# Altium schematic sheet rf_conn.SchDoc: mcHF Pro Transceiver RF board
size A3; Author: Krassi Atanassov; CompanyName: MØNKA; Engineer: For radio amateurs experimentation, non-commercial use only. Thank you!; Revision: 0.8.5; SheetTotal: 14
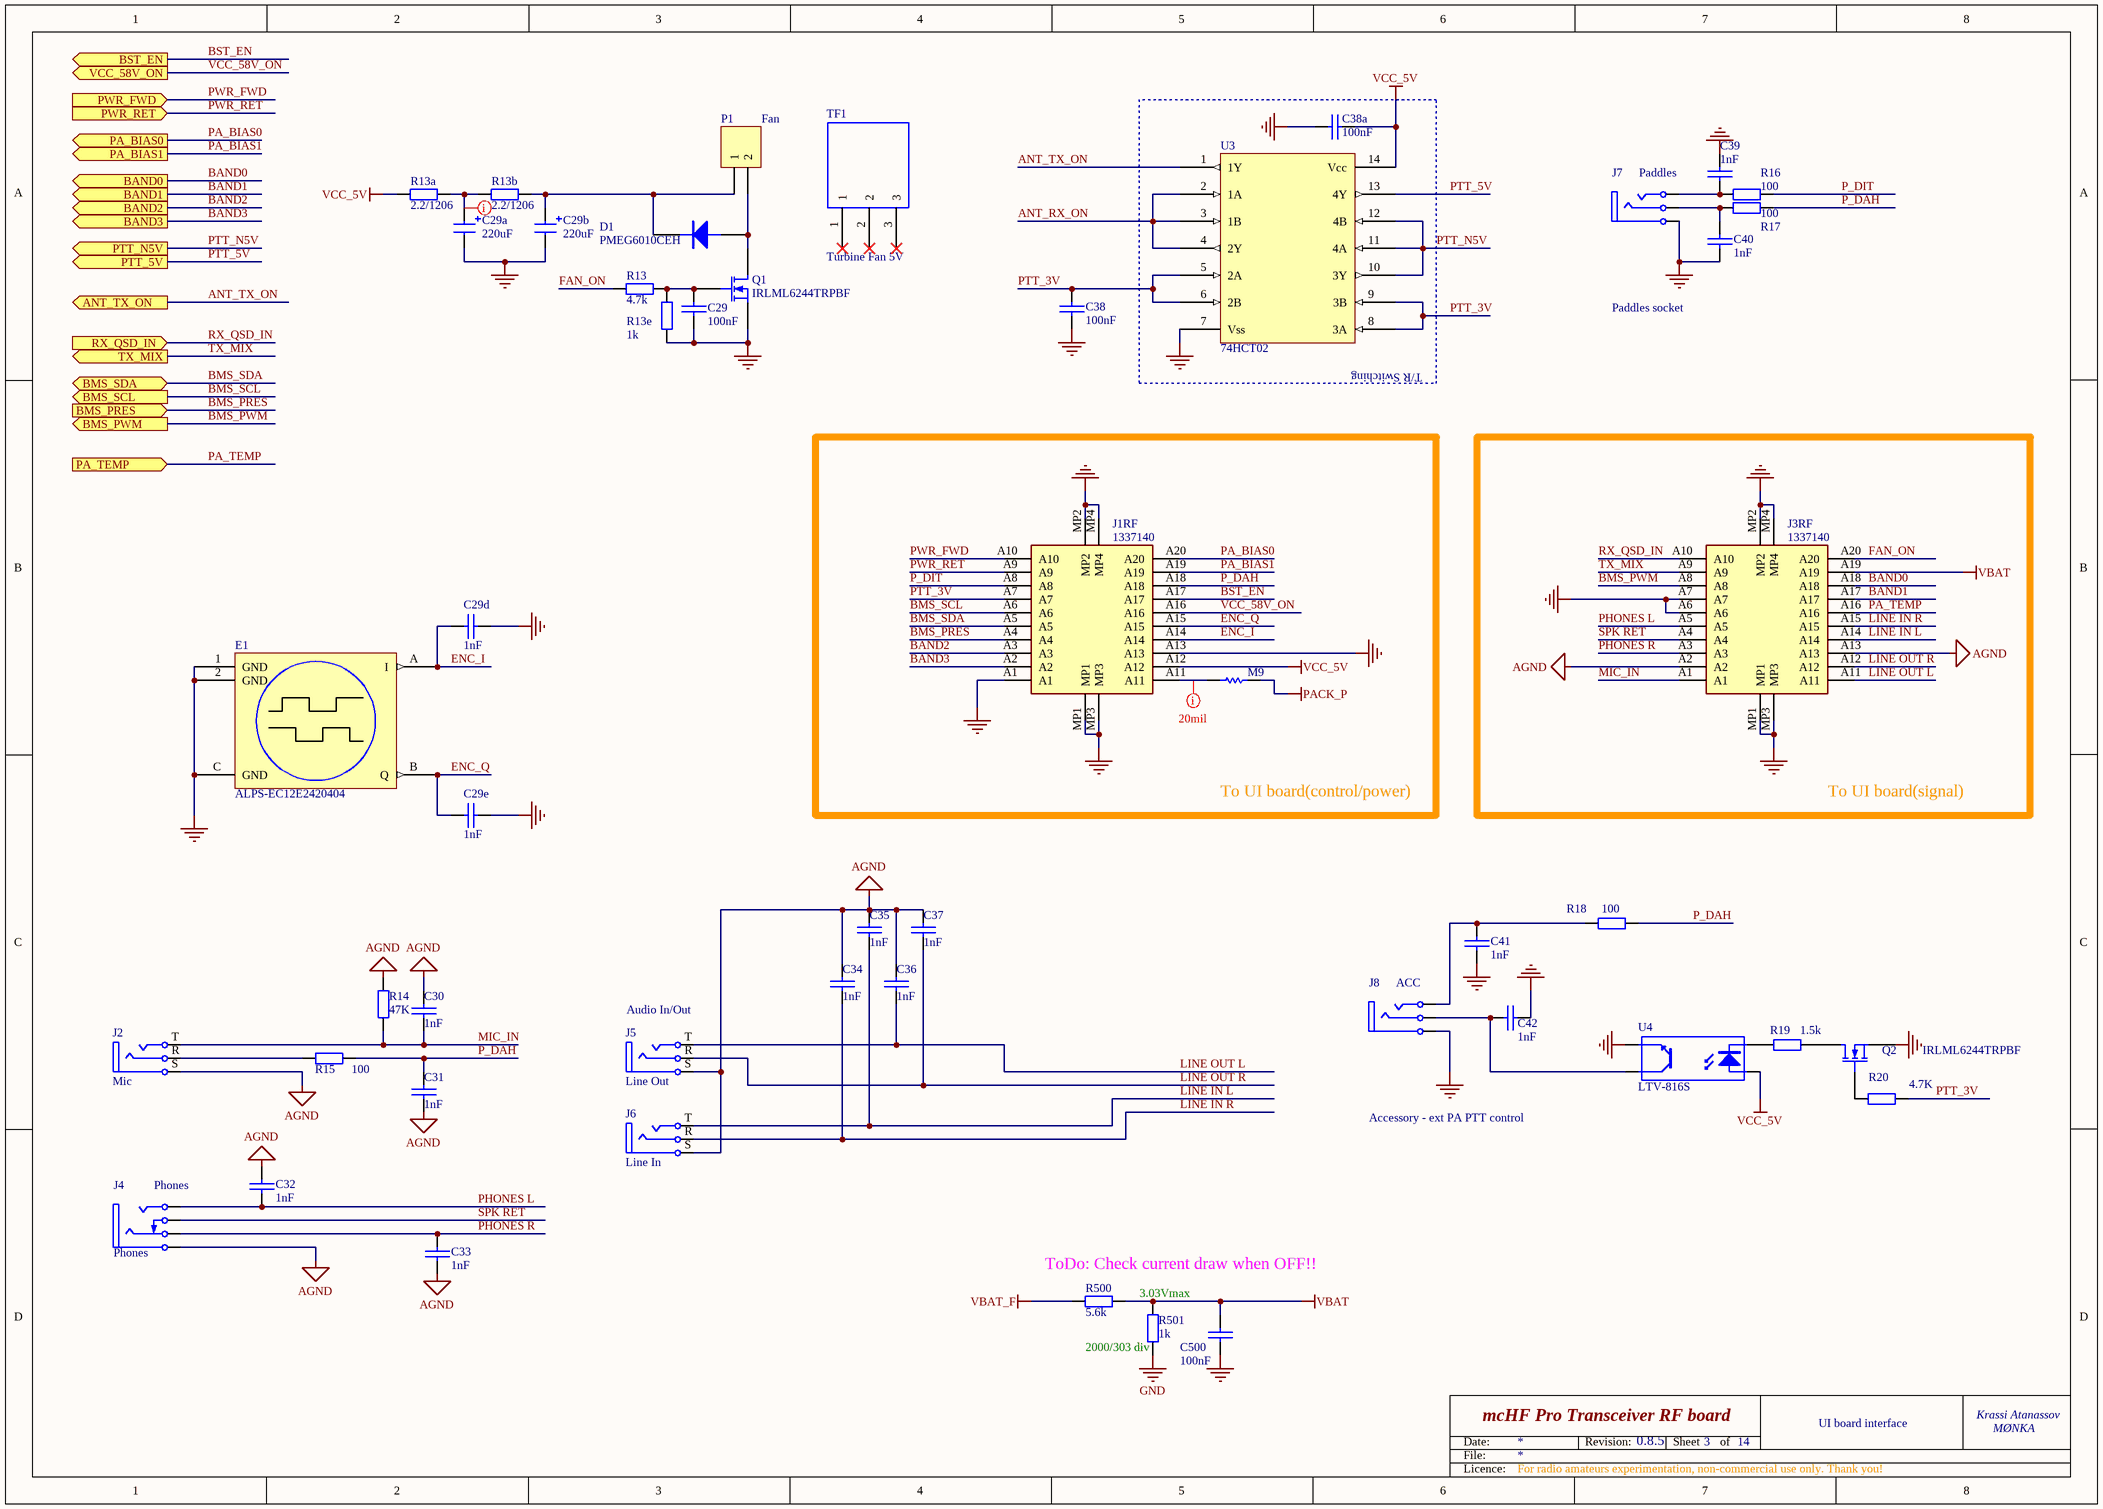
[diagram p0: rf_conn.SchDoc]

## Parts
C29  100nF  [0805]
C29a  220uF  [CAP_ALUM_Pro]
C29b  220uF  [CAP_ALUM_Pro]
C29d  1nF  [0805]
C29e  1nF  [0805]
C30  1nF  [0805]
C31  1nF  [0805]
C32  1nF  [0805]
C33  1nF  [0805]
C34  1nF  [0805]
C35  1nF  [0805]
C36  1nF  [0805]
C37  1nF  [0805]
C38  100nF  [0805]
C38a  100nF  [0805]
C39  1nF  [0805]
C40  1nF  [0805]
C41  1nF  [0805]
C42  1nF  [0805]
C500  100nF  [0805]
D1  PMEG6010CEH  [SOD87]
E1  ALPS-EC12E2420404  [Encoder]
J1RF  1337140  [1373866]
J2  Mic  [MX-387GL_new1]
J3RF  1337140  [1373866]
J4  Phones  [KLBR4]
J5  Line Out  [MX-387GL_new1]
J6  Line In  [MX-387GL_new1]
J7  Paddles  [MX-387GL_new1]
J8  ACC  [MX-387GL_new1]
M9  0  [SB_0603_10]  (value not drawn)  (net tie, no BOM)
P1  Fan  [MHDR1X2_m]
Q1  IRLML6244TRPBF  [SOT-23-Pro]
Q2  IRLML6244TRPBF  [SOT-23-Pro]
R13  4.7k  [0805]
R13a  2.2/1206  [1206]
R13b  2.2/1206  [1206]
R13e  1k  [0805]
R14  47K  [0805]
R15  100  [0805]
R16  100  [0805]
R17  100  [0805]
R18  100  [0805]
R19  1.5k  [0805]
R20  4.7K  [0805]
R500  5.6k  [0805]
R501  1k  [0805]
TF1  Turbine Fan 5V  [TFAN]
U3  74HCT02  [SO-14]
U4  LTV-816S  [SMDIP-4_new1]

## Blocks framed on the sheet
T/R Switching: C38a U3
To UI board(control/power): J1RF M9
To UI board(signal): J3RF

## Ports
ANT_TX_ON (out), BAND0 (out), BAND1 (out), BAND2 (out), BAND3 (out), BMS_PRES (in), BMS_PWM (out), BMS_SCL (out), BMS_SDA (bidir), BST_EN (out), PA_BIAS0 (out), PA_BIAS1 (out), PA_TEMP (in), PTT_5V (out), PTT_N5V (out), PWR_FWD (in), PWR_RET (in), RX_QSD_IN (in), TX_MIX (out), VCC_58V_ON (out)

## Nets
AGND: C30.1 C31.2 C32.2 C33.1 C34.1 C35.1 C36.1 C37.1 J2.S J3RF.A2 J3RF.A13 J4.S J5.S J6.S R14.2
GND: C29.2 C29a.2 C29b.2 C29d.2 C29e.2 C38.2 C38a.2 C39.2 C40.1 C41.2 C42.1 C500.2 E1.1(GND) E1.2(GND) E1.C(GND) J1RF.A1 J1RF.A13 J1RF.MP1 J1RF.MP2 J1RF.MP3 J1RF.MP4 J3RF.A6 J3RF.A7 J3RF.MP1 J3RF.MP2 J3RF.MP3 J3RF.MP4 J7.S J8.S Q1.2(S) Q2.2(S) R13e.2 R501.2 U3.7(Vss) U4.3(E)
PACK_P: M9.2
VBAT: C500.1 J3RF.A19 R500.2 R501.1
VBAT_F: R500.1
VCC_5V: C38a.1 J1RF.A12 R13a.1 U3.14(Vcc) U4.1(A)
ANT_RX_ON: U3.2(1A) U3.3(1B) U3.4(2Y)
ANT_TX_ON: U3.1(1Y) ; port ANT_TX_ON
BAND0: J3RF.A18 ; port BAND0
BAND1: J3RF.A17 ; port BAND1
BAND2: J1RF.A3 ; port BAND2
BAND3: J1RF.A2 ; port BAND3
BMS_PRES: J1RF.A4 ; port BMS_PRES
BMS_PWM: J3RF.A8 ; port BMS_PWM
BMS_SCL: J1RF.A6 ; port BMS_SCL
BMS_SDA: J1RF.A5 ; port BMS_SDA
BST_EN: J1RF.A17 ; port BST_EN
ENC_I: C29d.1 E1.A(I) J1RF.A14
ENC_Q: C29e.1 E1.B(Q) J1RF.A15
FAN_ON: J3RF.A20 R13.2
LINE IN L: C35.2 J3RF.A14 J6.T
LINE IN R: C34.2 J3RF.A15 J6.R
LINE OUT L: C36.2 J3RF.A11 J5.T
LINE OUT R: C37.2 J3RF.A12 J5.R
MIC_IN: C30.2 J2.T J3RF.A1 R14.1
P_DAH: C31.1 J1RF.A18 R15.2 R17.1 R18.1
P_DIT: J1RF.A8 R16.1
PA_BIAS0: J1RF.A20 ; port PA_BIAS0
PA_BIAS1: J1RF.A19 ; port PA_BIAS1
PA_TEMP: J3RF.A16 ; port PA_TEMP
PHONES L: C32.1 J3RF.A5 J4.T
PHONES R: C33.2 J3RF.A3 J4.R
PTT_3V: C38.1 J1RF.A7 R20.2 U3.5(2A) U3.6(2B) U3.8(3A) U3.9(3B)
PTT_5V: U3.13(4Y) ; port PTT_5V
PTT_N5V: U3.10(3Y) U3.11(4A) U3.12(4B) ; port PTT_N5V
PWR_FWD: J1RF.A10 ; port PWR_FWD
PWR_RET: J1RF.A9 ; port PWR_RET
RX_QSD_IN: J3RF.A10 ; port RX_QSD_IN
SPK RET: J3RF.A4 J4.B
TX_MIX: J3RF.A9 ; port TX_MIX
VCC_58V_ON: J1RF.A16 ; port VCC_58V_ON
NetC29_1: C29.1 Q1.1(G) R13.1 R13e.1
NetC29a_1: C29a.1 R13a.2 R13b.1
NetC29b_1: C29b.1 D1.2(K) P1.1 R13b.2
NetC39_1: C39.1 J7.T R16.2
NetC40_2: C40.2 J7.R R17.2
NetC41_1: C41.1 J8.T R18.2
NetC42_2: C42.2 J8.R U4.4(C)
NetD1_1: D1.1(A) P1.2 Q1.3(D)
NetJ1RF_A11: J1RF.A11 M9.1
NetJ2_R: J2.R R15.1
NetQ2_1: Q2.1(G) R20.1
NetQ2_3: Q2.3(D) R19.2
NetR19_1: R19.1 U4.2(K)

Not connected (* = marked no-connect by the designer): TF1 1* 2* 3*

## Layout directives
rule Width Constraint [Pref Width = 20mil    Min Width = 20mil    Max Width = 80mil]: NetJ1RF_A11
rule Width Constraint [Pref Width = 12mil    Min Width = 12mil    Max Width = 12mil]: NetC29a_1

## Notes on the sheet
- Paddles socket
- (near J5) Audio In/Out
- Accessory - ext PA PTT control
- ToDo: Check current draw when OFF!!
- (near R501) 3.03Vmax
- (near R501) 2000/303 div
- 3
- UI board interface
- Date:
- File:
- Revision:
- Sheet
- of
- Licence:

## Library data of the parts
C29 C29d C29e C30-C37 = CAP: Capacitor; Order: FN 185-6408; QT Order: QCC-00259; Price: 0.01
C29a = CAP-POL: Electrolitic capacitor; Order: FN 225-4321; QT Order: QCC-00320; Price: 0.34
C29b = CAP-POL: Electrolitic capacitor; Notes: Aluminium capacitor; Price: 0.34
C38 C38a C500 = CAP: Capacitor; QT Order: QCC-00154; Price: 0.068
C39-C42 = CAP: Capacitor; QT Order: QCC-00259; Price: 0.01
D1 = PMEG6010CEH: DIODE, SCHOTTKY, 1A, 60V, SOD-123F; QT Order: QCD-00034; Price: 0.085
E1 = Encoder: ALPS Rotary Encoder
J1RF J3RF = 1373866: SMD male connector, nominal current: 2.2 A, Test voltage: 840 VAC, number of positions: 20, pitch: 1.27 mm, color: black, contact surface: Gold, type of contact: Male connector, mounting: SMD soldering; Manufacturer_Name: Phoenix Contact; Geometry.Height: 6.75mm; Mouser Part Number: 651-1373866; Mouser Price/Stock: https://www.mouser.co.uk/ProductDetail/Phoenix-Contact/1373866?qs=2SLPxufLcgAs0enIXKjUUw%3D%3D; Manufacturer_Part_Number: 1373866; Datasheet Link: http://www.phoenixcontact.com/gb/produkte/1373866
J2 J5 J6 = MX-387GL: Jack Socket,Thru-Hole; Order: FN 126-7376
J4 = PhoneJack: Jack Socket 4 pin; Order: FN 121-7016; Price: 1.28; Function: Phones
J7 J8 = Phonejack3: Jack Socket,Thru-Hole; Notes: post assembly; Price: 0.35
  J7: Function: Paddles
  J8: Function: ACC
M9 = Link: Value: 1K; Published: 8-Jun-2000; Revision: July-2002: Re-released for DXP Platform.; Publisher: Altium Limited
P1 = MHDR1X2: Header, 2-Pin; LatestRevisionDate: 17-Jul-2002; LatestRevisionNote: Re-released for DXP Platform.; Publisher: Altium Limited
Q1 Q2 = MOSFET-N: N-Channel MOSFET; QT Order: QCT-00022; QT Price: 0.28; Price: 0.231
R13 R13e R14 = RES: Resistor; Order: FN 146-9929; QT Order: QCR-00365; Price: 0.021
R13a R13b = RES: Resistor; Order: FN 207-8984; QT Order: QCR-00412; Price: 0.02
R15 = RES: Resistor; Order: FN 933-2375; QT Order: QCR-00301; Price: 0.027
R16-R18 = RES: Resistor; QT Order: QCR-00301; Price: 0.027
R19 = RES: Resistor; QT Order: QCR-00579; Price: 0.061
R20 = RES: Resistor; QT Order: QCR-00341; Price: 0.024
R500 R501 = RES: Resistor; Notes: Tolerance better than 1%; Price: 0.009
TF1 = FAN5V: 5V Turbine Fan, 40x40mm; Order: FN 118-1070; Price: 2.19
U3 = 74HCT02: Quad 2-input NOR gate; QT Order: QCI-01079; Price: 0.38
U4 = ISP817XSM: OPTOCOUPLER, SMDIP-4, TR O/P; Order: FN 168-3292; Notes: v 0.6 RF board opto can do, but more expensive; Price: 0.26